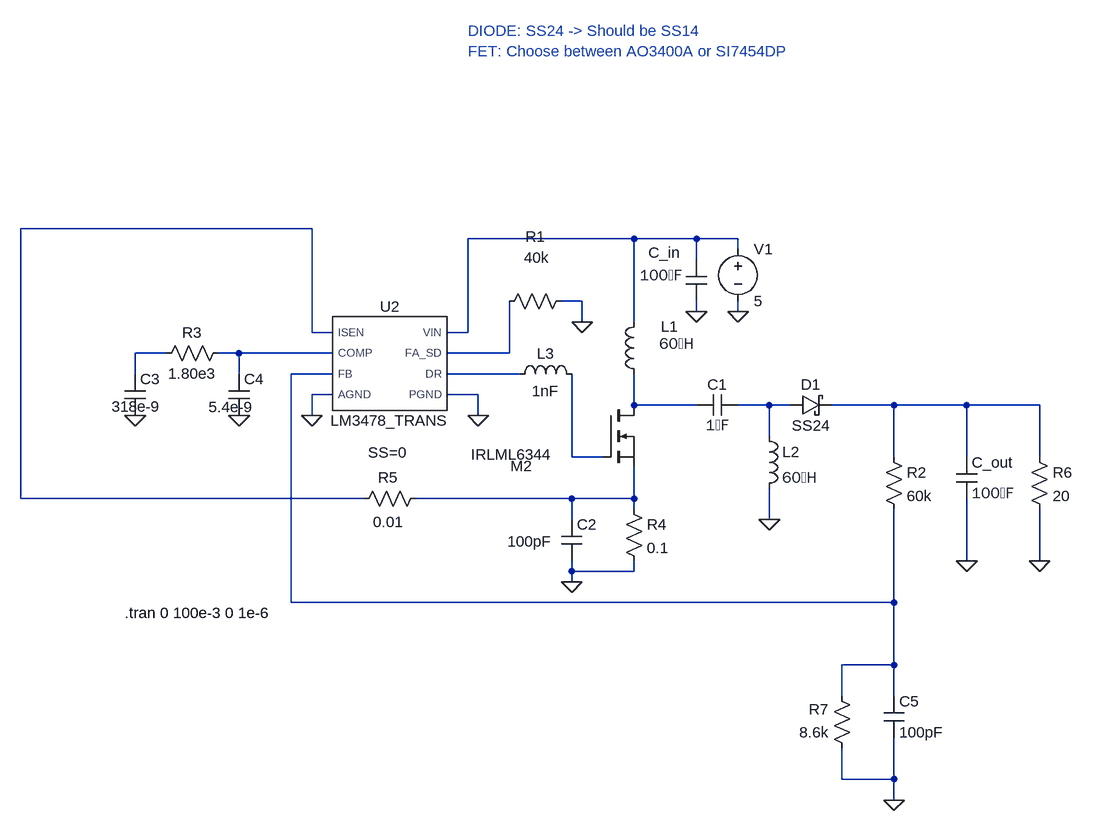
[diagram p0: schematic sepic_5V_carrier.asc]
sepic_5V_carrier.asc, the LTspice schematic file:
Version 4
SHEET 1 936 1396
WIRE -240 -80 -688 -80
WIRE 256 -64 0 -64
WIRE 352 -64 256 -64
WIRE 416 -64 352 -64
WIRE 416 -48 416 -64
WIRE 352 -32 352 -64
WIRE 176 32 144 32
WIRE 352 48 352 32
WIRE 416 48 416 32
WIRE 176 64 176 32
WIRE 256 64 256 -64
WIRE -240 80 -240 -80
WIRE -208 80 -240 80
WIRE 0 80 0 -64
WIRE 0 80 -32 80
WIRE -464 112 -512 112
WIRE -352 112 -384 112
WIRE -208 112 -352 112
WIRE 64 112 64 32
WIRE 64 112 -32 112
WIRE -512 144 -512 112
WIRE -352 144 -352 112
WIRE -208 144 -272 144
WIRE 80 144 -32 144
WIRE -208 176 -240 176
WIRE 16 176 -32 176
WIRE 256 192 256 144
WIRE 352 192 256 192
WIRE 464 192 416 192
WIRE 496 192 464 192
WIRE 656 192 560 192
WIRE 768 192 656 192
WIRE 880 192 768 192
WIRE -240 208 -240 176
WIRE 16 208 16 176
WIRE 464 240 464 192
WIRE 160 272 160 144
WIRE 208 272 160 272
WIRE 656 272 656 192
WIRE 768 272 768 192
WIRE 880 272 880 192
WIRE -688 336 -688 -80
WIRE -160 336 -688 336
WIRE 160 336 -80 336
WIRE 256 336 256 288
WIRE 256 336 160 336
WIRE 256 352 256 336
WIRE 160 368 160 336
WIRE 464 368 464 320
WIRE 768 432 768 336
WIRE 880 432 880 352
WIRE 160 448 160 432
WIRE 256 448 256 432
WIRE 256 448 160 448
WIRE 160 464 160 448
WIRE -272 496 -272 144
WIRE 656 496 656 352
WIRE 656 496 -272 496
WIRE 656 592 656 496
WIRE 656 592 576 592
WIRE 576 640 576 592
WIRE 656 640 656 592
WIRE 576 768 576 720
WIRE 656 768 656 704
WIRE 656 768 576 768
WIRE 656 800 656 768
FLAG 176 64 0
FLAG -240 208 0
FLAG 16 208 0
FLAG 160 464 0
FLAG 880 432 0
FLAG 416 48 0
FLAG 352 48 0
FLAG 768 432 0
FLAG 464 368 0
FLAG 656 800 0
FLAG -512 208 0
FLAG -352 208 0
SYMBOL ind 272 160 R180
WINDOW 0 -52 89 Left 2
WINDOW 3 -76 62 Left 2
SYMATTR InstName L1
SYMATTR Value 60�H
SYMBOL res 48 48 R270
WINDOW 0 100 56 VTop 2
WINDOW 3 99 58 VBottom 2
SYMATTR InstName R1
SYMATTR Value 40k
SYMBOL schottky 496 208 R270
WINDOW 0 32 32 VTop 2
WINDOW 3 0 32 VBottom 2
SYMATTR InstName D1
SYMATTR Value SS24
SYMATTR Description Diode
SYMATTR Type diode
SYMBOL cap 752 272 R0
SYMATTR InstName C_out
SYMATTR Value 100�F
SYMBOL res 640 256 R0
SYMATTR InstName R2
SYMATTR Value 60k
SYMBOL cap 144 368 R0
WINDOW 3 -83 34 Left 2
SYMATTR Value 100pF
SYMATTR InstName C2
SYMBOL res 240 336 R0
SYMATTR InstName R4
SYMATTR Value 0.1
SYMBOL res 864 256 R0
SYMATTR InstName R6
SYMATTR Value 20
SYMBOL voltage 416 -64 R0
WINDOW 123 0 0 Left 0
WINDOW 39 0 0 Left 0
SYMATTR InstName V1
SYMATTR Value 5
SYMBOL cap 336 -32 R0
WINDOW 0 -58 -11 Left 2
WINDOW 3 -71 25 Left 2
SYMATTR InstName C_in
SYMATTR Value 100�F
SYMBOL LM3478_TRANS -128 128 R0
WINDOW 39 4 121 Top 2
SYMATTR InstName U2
SYMBOL ind 448 224 R0
SYMATTR InstName L2
SYMATTR Value 60�H
SYMBOL cap 416 176 R90
WINDOW 0 0 32 VBottom 2
WINDOW 3 32 32 VTop 2
SYMATTR InstName C1
SYMATTR Value 1�F
SYMBOL cap 640 640 R0
SYMATTR InstName C5
SYMATTR Value 100pF
SYMBOL res 592 736 R180
WINDOW 0 36 76 Left 2
WINDOW 3 36 40 Left 2
SYMATTR InstName R7
SYMATTR Value 8.6k
SYMBOL cap -528 144 R0
WINDOW 3 -20 50 Left 2
SYMATTR Value 318e-9
SYMATTR InstName C3
SYMBOL cap -368 144 R0
WINDOW 3 -31 51 Left 2
SYMATTR Value 5.4e-9
SYMATTR InstName C4
SYMBOL res -368 96 R90
WINDOW 0 0 56 VBottom 2
WINDOW 3 32 56 VTop 2
SYMATTR InstName R3
SYMATTR Value 1.80e3
SYMBOL res -176 352 R270
WINDOW 0 33 53 VTop 2
WINDOW 3 -4 54 VBottom 2
SYMATTR InstName R5
SYMATTR Value 0.01
SYMBOL ind 64 160 R270
WINDOW 0 32 56 VTop 2
WINDOW 3 5 56 VBottom 2
SYMATTR InstName L3
SYMATTR Value 1nF
SYMATTR SpiceLine Rser=1
SYMBOL nmos 208 192 R0
WINDOW 0 -142 94 Left 2
WINDOW 3 -203 76 Left 2
SYMATTR InstName M2
SYMATTR Value IRLML6344
TEXT -528 512 Left 2 !.tran 0 100e-3 0 1e-6
TEXT 0 -384 Left 2 ;DIODE: SS24 -> Should be SS14\nFET: Choose between AO3400A or SI7454DP

The netlist it stands for:
* sepic_5V_carrier.asc
L1 N008 N002 60�H
R1 N005 0 40k
D1 N009 N010 SS24
C_out N010 0 100�F
R2 N010 N006 60k
C2 N012 0 100pF
R4 N012 0 0.1
R6 N010 0 20
V1 N002 0 5
C_in N002 0 100�F
XU2 0 N004 N007 N005 N006 N001 0 N002 LM3478_TRANS SS=0  ; pins AGND COMP DR FA_SD FB ISEN PGND VIN
L2 N009 0 60�H
C1 N009 N008 1�F
C5 N006 0 100pF
R7 0 N006 8.6k
C3 N003 0 318e-9
C4 N004 0 5.4e-9
R3 N004 N003 1.80e3
R5 N001 N012 0.01
L3 N007 N011 1nF Rser=1
M2 N008 N011 N012 N012 IRLML6344
.model D D
.lib standard.dio
.model NMOS NMOS
.model PMOS PMOS
.lib standard.mos
.tran 0 100e-3 0 1e-6
* DIODE: SS24 -> Should be SS14
* FET: Choose between AO3400A or SI7454DP
.lib C:\users\iwolfs\Favorites\acoustic-material-characterization\acoustic-piezodriver-hw\simulations\libs\LM3478_TRANS.lib
.backanno
.end